# Altium schematic sheet Interface - BLDC Connection.SchDoc: [21] Interface - BLDC Connection
size A4; ApprovedBy: Nagy Richard; CheckedBy: Nagy Richard; Author: Nagy Richard; CompanyName: EmbedCore; DrawnBy: Nagy Richard; Engineer: Nagy Richard; Organization: EmbedCore; DocumentNumber: 21; Revision: 1.0; SheetNumber: 21; SheetTotal: 21
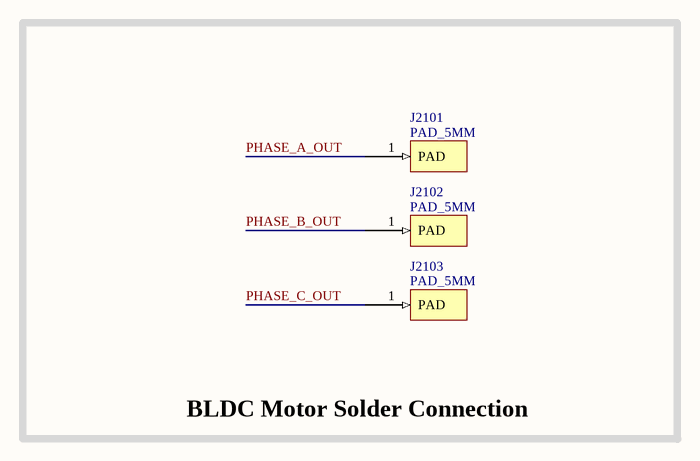
[diagram p0: Interface - BLDC Connection.SchDoc]

## Parts
J2101  PAD_5MM  [PAD_5MM]
J2102  PAD_5MM  [PAD_5MM]
J2103  PAD_5MM  [PAD_5MM]

## Blocks framed on the sheet
BLDC Motor Solder Connection: J2101-J2103

## Nets
PHASE_A_OUT: J2101.1(PAD)
PHASE_B_OUT: J2102.1(PAD)
PHASE_C_OUT: J2103.1(PAD)

## Notes on the sheet
- Title:
- Drawn By:
- Page Contents:
- Checked By:
- Size:
- Date:
- File:
- License:
- Email:
- A4
- Number:
- Time:
- Revision:
- Sheet
- Website:
- of